# Altium schematic sheet Block-Diagram.SchDoc
size A4; Organization: Altium Limited; Address1: L3, 12a Rodborough Rd; Address2: Frenchs Forest; Address3: NSW; Address4: Australia 2086
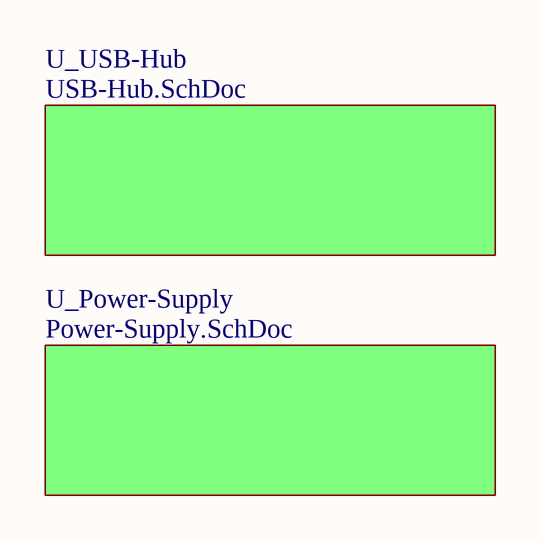
[diagram p0: Block-Diagram.SchDoc]

## Sub-sheets
U_Power-Supply = Power-Supply.SchDoc: no entries
U_USB-Hub = USB-Hub.SchDoc: no entries

## Notes on the sheet
- Projeto:
- Tamanho:
- Data:
- A4
- Eng. Felipe Navarro
- Hora:
- Revisão:
- Folha
- de
- Arquivo: